# EAGLE design mkrd-002 (EAGLE 9.6.2)
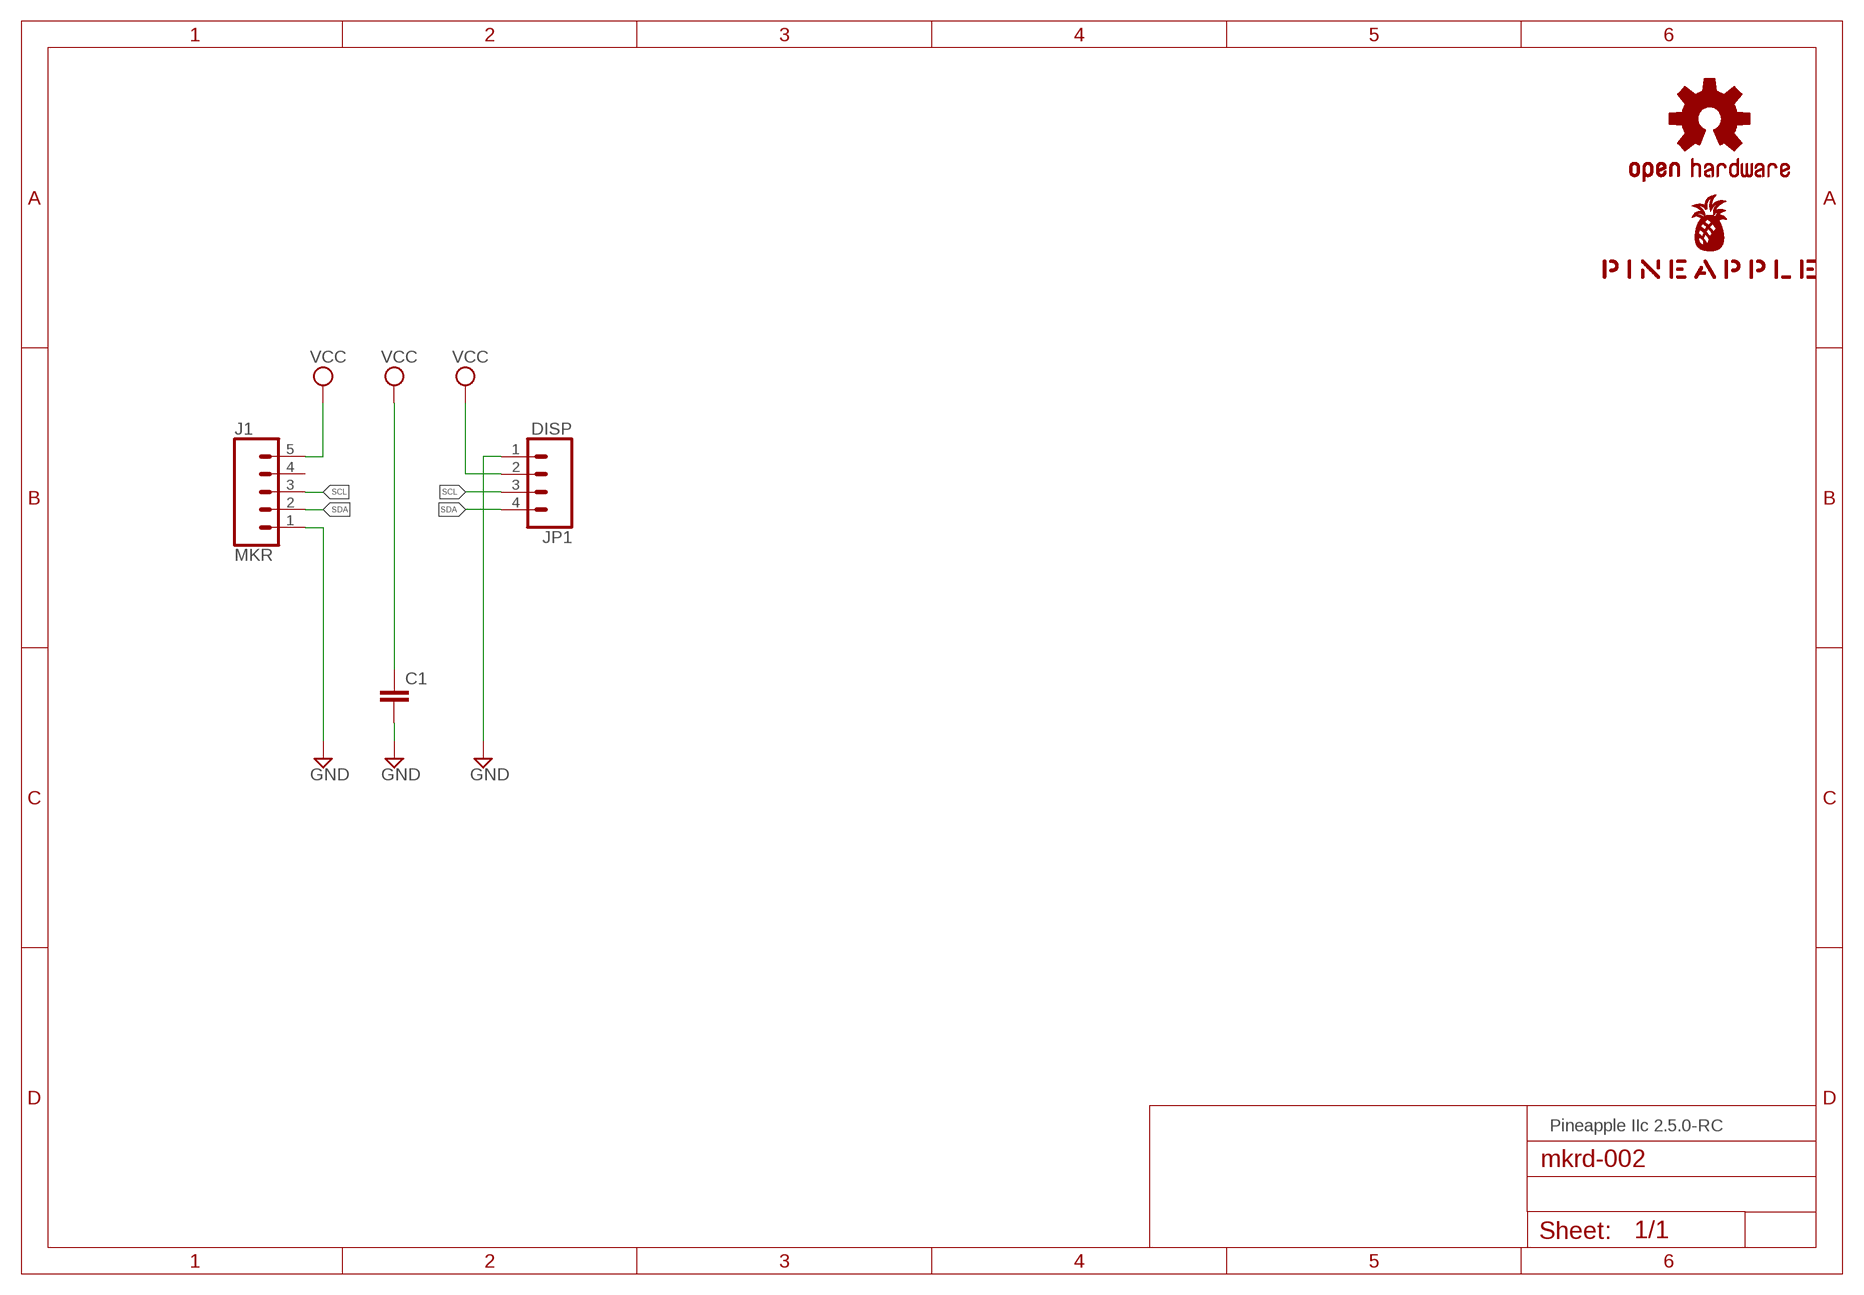
[diagram p0: schematic, sheet 1]

## Parts
C1  C-EU025-024X044  [C025-024X044]
J1  MKR  CONN_05JST  [JST-5-PTH]
JP1  DISP  CONN_04  [1X04]
LOGO1  OSHW-LOGOS-COPPER  [OSHW-LOGO-S_COPPER]
U$1  PINEAPPLE450_SILK  [PINEAPPLE450_SILK]

## Nets
GND: C1.2 J1.1 JP1.1
SCL: J1.3 JP1.3
SDA: J1.2 JP1.4
VCC: C1.1 J1.5 JP1.2
Unconnected: J1.4

## Notes on the sheet
- Pineapple IIc 2.5.0-RC

## Library data of the parts
C1 = rcl:C-EU: CAPACITOR, European symbol; SPICEPREFIX: C
J1 = SparkFun-Connectors:CONN_05: Multi connection point. Often used as Generic Header-pin footprint for 0.1 inch spaced/style header connections On any of the 0.1 inch spaced packages, you can populate with these: Break Away Headers - Straight <https://www.sparkfun.com/products/116> (PRT-00116) Break Away Male Headers - Right Angle <https://www.sparkfun.com/products/553> (PRT-00553) Female Headers <https://www.sparkfun.com/products/115> (PRT-00115) Break Away Headers - Machine Pin <https://www.sparkfun.com/products/117> (PRT-00117) Break Away Female Headers - Swiss Machine Pin <https://www.sparkfun.com/products/743> (PRT-00743) For SCREWTERMINALS and SPRING TERMINALS visit here: Screw Terimnals on SparkFun.com <https://www.sparkfun.com/search/results?term=Screw+Terminals> (5mm/3.5mm/2.54mm spacing) This device is also useful as a general connection point to wire up your design to another part of your project. Our various solder wires solder well into these plated through hole pads. Hook-Up Wire - Assortment (Stranded, 22 AWG) <https://www.sparkfun.com/products/11375> (PRT-11375) Hook-Up Wire - Assortment (Solid Core, 22 AWG) <https://www.sparkfun.com/products/11367> (PRT-11367) View the entire wire category on our website here <https://www.sparkfun.com/categories/141> Special notes: Molex polarized connector foot print use with SKU : PRT-08231 with associated crimp pins and housings. 1MM SMD Version SKU: PRT-10208; SF_ID: PRT-09917
JP1 = SparkFun-Connectors:CONN_04: Multi connection point. Often used as Generic Header-pin footprint for 0.1 inch spaced/style header connections On any of the 0.1 inch spaced packages, you can populate with these: Break Away Headers - Straight <https://www.sparkfun.com/products/116> (PRT-00116) Break Away Male Headers - Right Angle <https://www.sparkfun.com/products/553> (PRT-00553) Female Headers <https://www.sparkfun.com/products/115> (PRT-00115) Break Away Headers - Machine Pin <https://www.sparkfun.com/products/117> (PRT-00117) Break Away Female Headers - Swiss Machine Pin <https://www.sparkfun.com/products/743> (PRT-00743) For SCREWTERMINALS and SPRING TERMINALS visit here: Screw Terimnals on SparkFun.com <https://www.sparkfun.com/search/results?term=Screw+Terminals> (5mm/3.5mm/2.54mm spacing) This device is also useful as a general connection point to wire up your design to another part of your project. Our various solder wires solder well into these plated through hole pads. Hook-Up Wire - Assortment (Stranded, 22 AWG) <https://www.sparkfun.com/products/11375> (PRT-11375) Hook-Up Wire - Assortment (Solid Core, 22 AWG) <https://www.sparkfun.com/products/11367> (PRT-11367) View the entire wire category on our website here <https://www.sparkfun.com/categories/141> Special notes: Molex polarized connector foot print use with SKU : PRT-08231 with associated crimp pins and housings. 1MM SMD Version SKU: PRT-10208; PROD_ID: CONN-09696
LOGO1 = SparkFun-Aesthetics:OSHW-LOGO: Open-Source Hardware (OSHW) Logo This logo indicates the piece of hardware it is found on incorporates a OSHW license and/or adheres to the definition of open source hardware found here: http://freedomdefined.org/OSHW
U$1 = pineapple:PINEAPPLE450_SILK

## Net classes
0 default: width 0.152 mm, drill 0.152 mm, clearance 0.152 mm
1 ground: width 0.305 mm, drill 0.152 mm, clearance 0.152 mm
2 power1: width 0.508 mm, drill 0.152 mm, clearance 0.152 mm
3 power2: width 0.61 mm, drill 0.152 mm, clearance 0.152 mm
4 analog: width 0.305 mm, drill 0.152 mm, clearance 0.152 mm
5 external: width 0.152 mm, drill 0.152 mm, clearance 0.152 mm

## Board
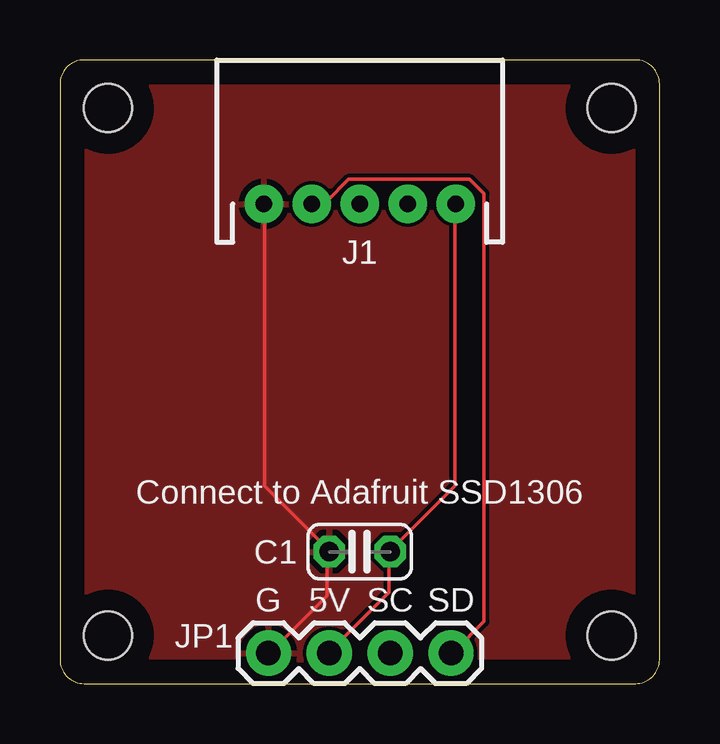
[diagram p1: board, top side]
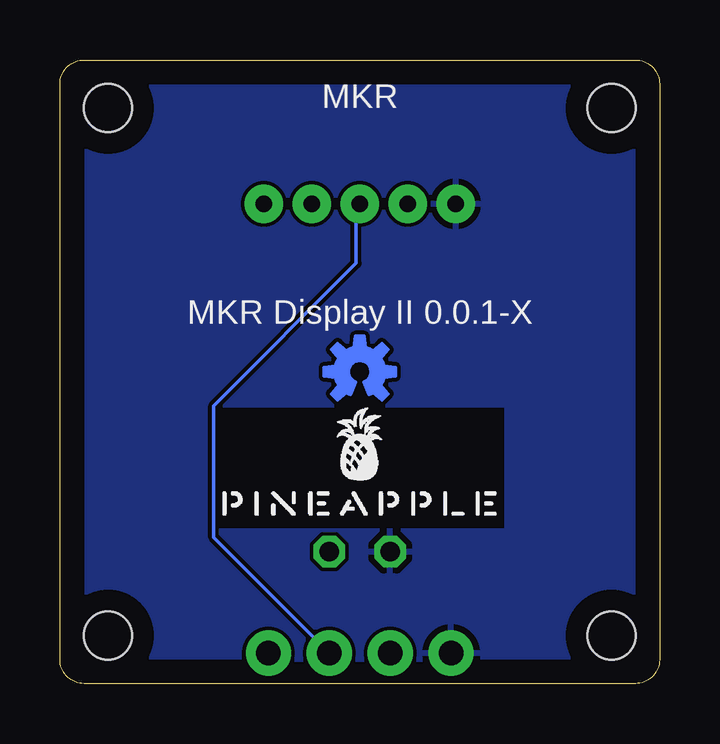
[diagram p2: board, bottom side, seen from below]

Size 25 x 26 mm. Coordinates in mm from the lower left corner, seen from the top.
Outline: 0,25 0,1 arc90 1,0 24,0 arc90 25,1 25,25 arc90 24,26 1,26 arc90 0,25
Copper layers (1*16): Top 0.035mm / dielectric 1.5mm / Bottom 0.035mm
Design rules "SeeedStudio_2layer_DRU_no_angle_20140221": minimum track width 6mil, minimum drill 12mil, track to track 6mil, track to pad 6mil, pad to pad 6mil, via to via 6mil, smd to smd 0mil, copper to edge 10mil, drill to drill 10mil, minimum pad ring 10mil, minimum via ring 6mil, stop-mask expansion 2mil, vias tented up to drill 100mil, thermal gap 10mil
Holes 2 mm at 2,2 23,2 23,24 2,24
tRestrict: area 0.2,0.2 to 3.8,3.8; area 0,0 to 1,26; area 0,25 to 25,26; area 24,0 to 25,26; area 0,0 to 7.5,1; area 0.2,22.2 to 3.8,25.8; area 21.2,22.2 to 24.8,25.8; area 21.2,0.2 to 24.8,3.8; area 17.5,0 to 25,1
bRestrict: area 0,0 to 7.5,1; area 24,0 to 25,26; area 0,25 to 25,26; area 0,0 to 1,26; area 21.2,0.2 to 24.8,3.8; area 0.2,22.2 to 3.8,25.8; area 0.2,0.2 to 3.8,3.8; area 21.2,22.2 to 24.8,25.8; area 17.5,0 to 25,1; area 6.5,6.5 to 18.5,11.5

### Footprints (pad centres in the part's own frame; a part is rotated, then mirrored left to right if it is on the bottom)
C025-024X044 = drill 0.813 octagon: 1 -1.27,0; 2 1.27,0
JST-5-PTH = drill 0.7 pad 1.6: 1 -4,0; 2 -2,0; 3 0,0; 4 2,0; 5 4,0
1X04 = drill 1.016 pad 1.88: 1 0,0; 2 2.54,0; 3 5.08,0; 4 7.62,0

### Placement (x,y rotation side)
C1  12.5,5.5 180 top
J1  12.5,20 0 top
JP1  8.69,1.27 0 top
LOGO1  12.5,13 0 bottom
U$1  12.5,7 0 bottom

### Tracks (layer width: path | path; a pad name or v marks a point on that pad's centre or on a via)
GND
  Top 0.152: JP1.1 8.84,1.37 11.12,3.66 11.12,5.49 C1.2 11.12,5.64 8.53,8.23 8.53,19.96 J1.1
  pour Top: 1,1 24,1 24,25 1,25
  pour Bottom: 1,1 24,1 24,25 1,25
SCL
  Bottom 0.152: J1.3 12.65,19.96 12.65,17.53 18.59,11.58 18.59,6.1 13.87,1.37 JP1.3
SDA
  Top 0.152: J1.2 10.52,20.12 11.12,20.12 12.04,21.03 17.07,21.03 17.68,20.42 17.68,2.59 16.46,1.37 JP1.4
VCC
  Top 0.152: JP1.2 11.28,1.37 13.72,3.81 13.72,5.49 C1.1 13.87,5.64 16.46,8.23 16.46,19.96 J1.5

### Text on the board
tNames: Connect to Adafruit SSD1306 | G | 5V | SC | SD
bNames: MKR | MKR Display II 0.0.1-X